# EAGLE schematic DE10-STD-ADC-Sch (EAGLE 9.3.1)
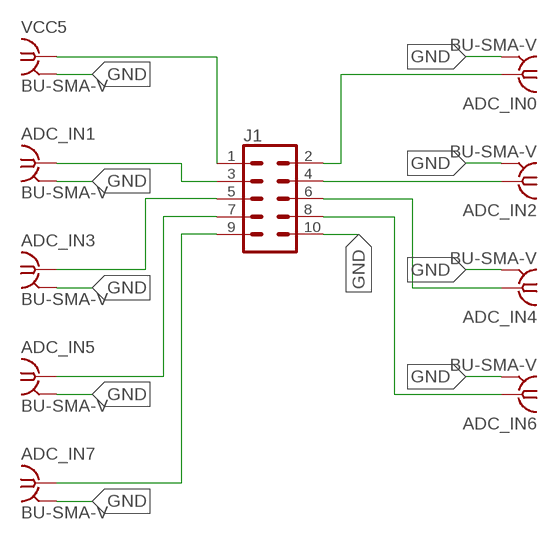
[diagram p0: schematic, sheet 1]

## Parts
ADC_IN0  BU-SMA-V  [BU-SMA-V]
ADC_IN1  BU-SMA-V  [BU-SMA-V]
ADC_IN2  BU-SMA-V  [BU-SMA-V]
ADC_IN3  BU-SMA-V  [BU-SMA-V]
ADC_IN4  BU-SMA-V  [BU-SMA-V]
ADC_IN5  BU-SMA-V  [BU-SMA-V]
ADC_IN6  BU-SMA-V  [BU-SMA-V]
ADC_IN7  BU-SMA-V  [BU-SMA-V]
J1  CONN_05X2SHD-NS  [2X5-SHROUDED-NS]
VCC5  BU-SMA-V  [BU-SMA-V]

## Nets
GND: ADC_IN0.2 ADC_IN0.3 ADC_IN0.4 ADC_IN0.5 ADC_IN1.2 ADC_IN1.3 ADC_IN1.4 ADC_IN1.5 ADC_IN2.2 ADC_IN2.3 ADC_IN2.4 ADC_IN2.5 ADC_IN3.2 ADC_IN3.3 ADC_IN3.4 ADC_IN3.5 ADC_IN4.2 ADC_IN4.3 ADC_IN4.4 ADC_IN4.5 ADC_IN5.2 ADC_IN5.3 ADC_IN5.4 ADC_IN5.5 ADC_IN6.2 ADC_IN6.3 ADC_IN6.4 ADC_IN6.5 ADC_IN7.2 ADC_IN7.3 ADC_IN7.4 ADC_IN7.5 J1.10 VCC5.2 VCC5.3 VCC5.4 VCC5.5
N$1: J1.1 VCC5.1
N$2: ADC_IN1.1 J1.3
N$3: ADC_IN3.1 J1.5
N$4: ADC_IN5.1 J1.7
N$5: ADC_IN7.1 J1.9
N$6: ADC_IN0.1 J1.2
N$7: ADC_IN2.1 J1.4
N$8: ADC_IN4.1 J1.6
N$9: ADC_IN6.1 J1.8

## Library data of the parts
ADC_IN0 ADC_IN1-ADC_IN7 VCC5 = con-coax:BU-SMA-V: FEMALE SMA CONNECTOR Radiall distributor RS 112-3794; OC_FARNELL: unknown; OC_NEWARK: unknown
J1 = SparkFun-Connectors:CONN_05X2: Multi connection point. Often used as Generic Header-pin footprint for 0.1 inch spaced/style header connections For AVR SPI programming port, see special device with nice symbol: "AVR_SPI_PROG_5x2.dev" You can populate with any combo of single row headers, but if you'd like an exact match, check these: 2x5 AVR ICSP Male Header <https://www.sparkfun.com/products/778> (PRT-00778) 2x5 Pin Shrouded Header <https://www.sparkfun.com/products/8506> (PRT-08506) On any of the 0.1 inch spaced packages, you can populate with these: Break Away Headers - Straight <https://www.sparkfun.com/products/116> (PRT-00116) Break Away Male Headers - Right Angle <https://www.sparkfun.com/products/553> (PRT-00553) Female Headers <https://www.sparkfun.com/products/115> (PRT-00115) Break Away Headers - Machine Pin <https://www.sparkfun.com/products/117> (PRT-00117) Break Away Female Headers - Swiss Machine Pin <https://www.sparkfun.com/products/743> (PRT-00743) Special note: the shrouded connector mates well with our 5x2 ribbon cables: 2x5 Pin IDC Ribbon Cable <https://www.sparkfun.com/products/8535> (PRT-08535); PROD_ID: CONN-08671; SF_ID: PRT-08506